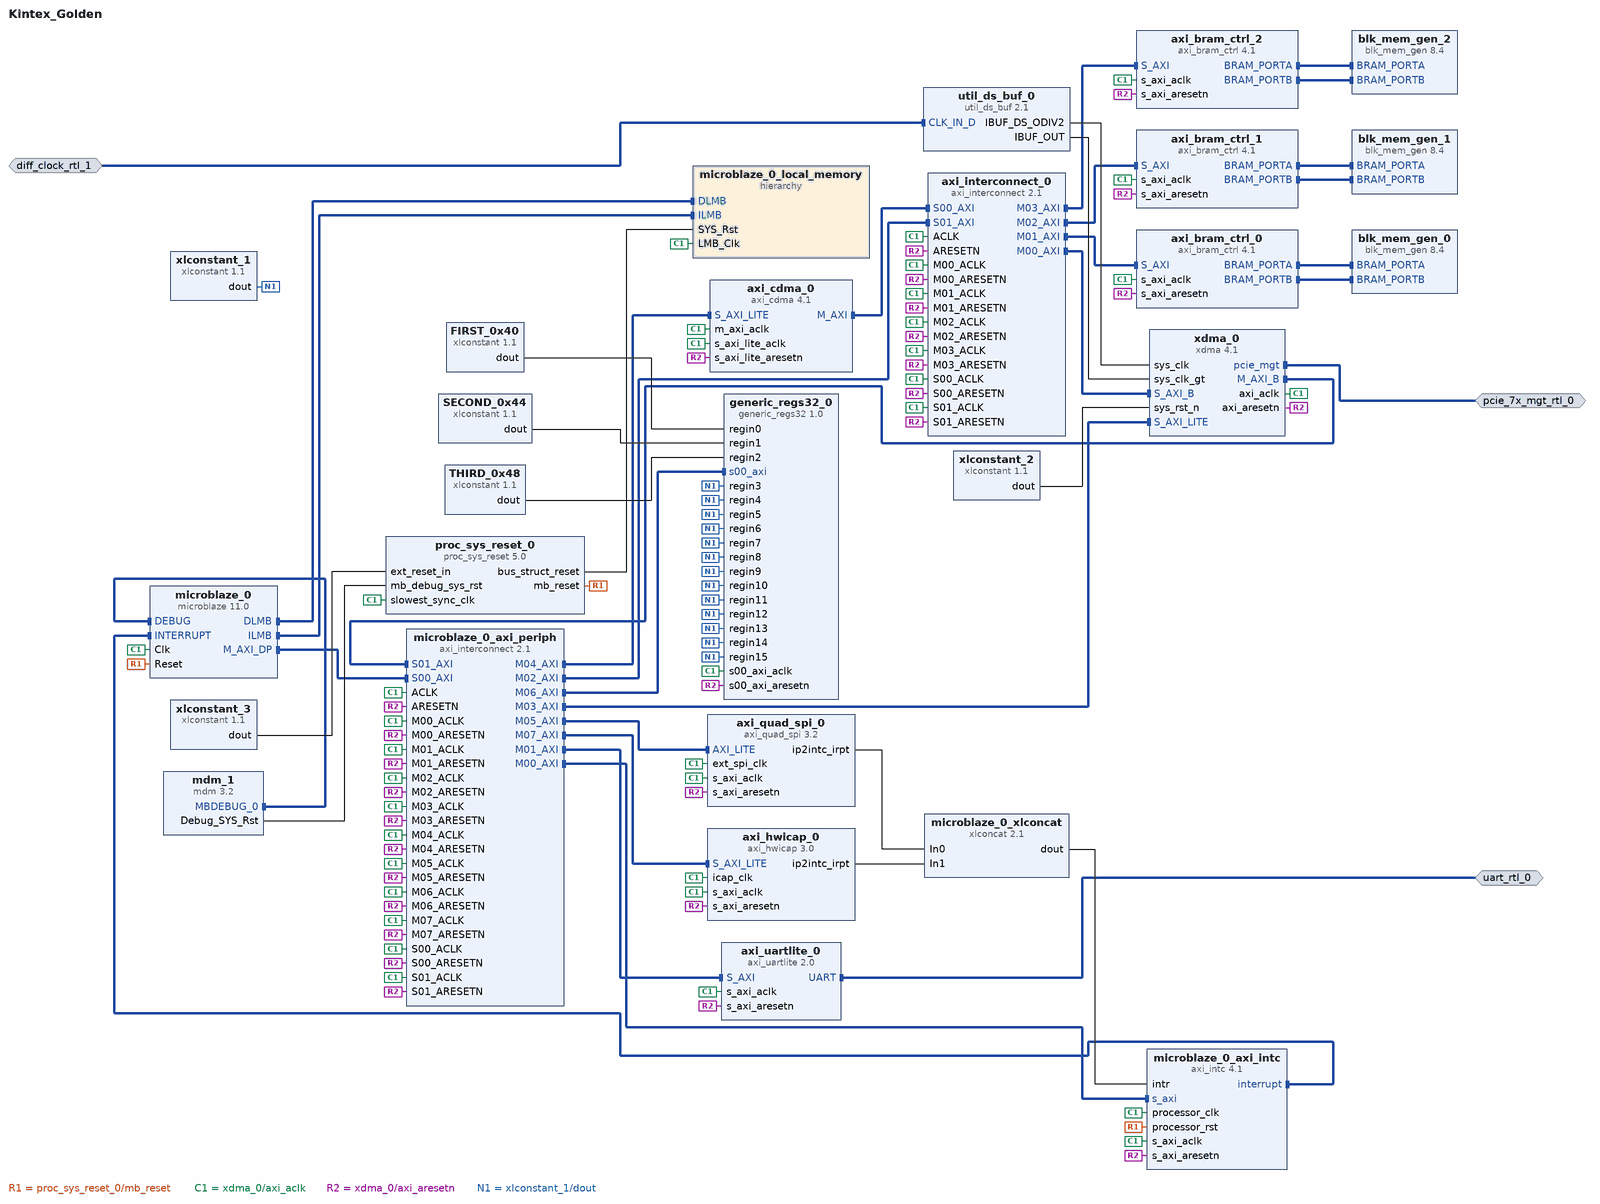
[diagram p0: block diagram of the top level]
# Vivado block design Kintex_Golden, xcku11p-ffva1156-2-i, Vivado 2020.1
create_bd_design Kintex_Golden

create_bd_intf_port -mode Slave -vlnv xilinx.com:interface:diff_clock_rtl:1.0 diff_clock_rtl_1
set_property -dict {CONFIG.FREQ_HZ 100000000} [get_bd_intf_ports diff_clock_rtl_1]
create_bd_intf_port -mode Master -vlnv xilinx.com:interface:pcie_7x_mgt_rtl:1.0 pcie_7x_mgt_rtl_0
create_bd_intf_port -mode Master -vlnv xilinx.com:interface:uart_rtl:1.0 uart_rtl_0

create_bd_cell -type ip -vlnv xilinx.com:ip:xlconstant:1.1 FIRST_0x40
set_property -dict {CONFIG.CONST_VAL 0x424F4F54 CONFIG.CONST_WIDTH 32} [get_bd_cells FIRST_0x40]
create_bd_cell -type ip -vlnv xilinx.com:ip:xlconstant:1.1 SECOND_0x44
set_property -dict {CONFIG.CONST_VAL 0x4C4F4144 CONFIG.CONST_WIDTH 32} [get_bd_cells SECOND_0x44]
create_bd_cell -type ip -vlnv xilinx.com:ip:xlconstant:1.1 THIRD_0x48
set_property -dict {CONFIG.CONST_VAL 0x00020003 CONFIG.CONST_WIDTH 32} [get_bd_cells THIRD_0x48]
create_bd_cell -type ip -vlnv xilinx.com:ip:axi_bram_ctrl:4.1 axi_bram_ctrl_0
create_bd_cell -type ip -vlnv xilinx.com:ip:axi_bram_ctrl:4.1 axi_bram_ctrl_1
create_bd_cell -type ip -vlnv xilinx.com:ip:axi_bram_ctrl:4.1 axi_bram_ctrl_2
create_bd_cell -type ip -vlnv xilinx.com:ip:axi_cdma:4.1 axi_cdma_0
set_property -dict {CONFIG.C_INCLUDE_SG 0} [get_bd_cells axi_cdma_0]
create_bd_cell -type ip -vlnv xilinx.com:ip:axi_hwicap:3.0 axi_hwicap_0
create_bd_cell -type ip -vlnv xilinx.com:ip:axi_interconnect:2.1 axi_interconnect_0
set_property -dict {CONFIG.NUM_MI 4 CONFIG.NUM_SI 2} [get_bd_cells axi_interconnect_0]
create_bd_cell -type ip -vlnv xilinx.com:ip:axi_quad_spi:3.2 axi_quad_spi_0
set_property -dict [list \
  CONFIG.C_FIFO_DEPTH 256 \
  CONFIG.C_SPI_MEMORY 2 \
  CONFIG.C_SPI_MODE 2 \
  CONFIG.C_TYPE_OF_AXI4_INTERFACE 0 \
  CONFIG.C_USE_STARTUP 1 \
  CONFIG.C_USE_STARTUP_INT 1 \
] [get_bd_cells axi_quad_spi_0]
create_bd_cell -type ip -vlnv xilinx.com:ip:axi_uartlite:2.0 axi_uartlite_0
set_property -dict {CONFIG.C_BAUDRATE 115200} [get_bd_cells axi_uartlite_0]
create_bd_cell -type ip -vlnv xilinx.com:ip:blk_mem_gen:8.4 blk_mem_gen_0
set_property -dict [list \
  CONFIG.Enable_B Use_ENB_Pin \
  CONFIG.Memory_Type True_Dual_Port_RAM \
  CONFIG.Port_B_Clock 100 \
  CONFIG.Port_B_Enable_Rate 100 \
  CONFIG.Port_B_Write_Rate 50 \
  CONFIG.Use_RSTB_Pin true \
] [get_bd_cells blk_mem_gen_0]
create_bd_cell -type ip -vlnv xilinx.com:ip:blk_mem_gen:8.4 blk_mem_gen_1
set_property -dict [list \
  CONFIG.Enable_B Use_ENB_Pin \
  CONFIG.Memory_Type True_Dual_Port_RAM \
  CONFIG.Port_B_Clock 100 \
  CONFIG.Port_B_Enable_Rate 100 \
  CONFIG.Port_B_Write_Rate 50 \
  CONFIG.Use_RSTB_Pin true \
] [get_bd_cells blk_mem_gen_1]
create_bd_cell -type ip -vlnv xilinx.com:ip:blk_mem_gen:8.4 blk_mem_gen_2
set_property -dict [list \
  CONFIG.Enable_B Use_ENB_Pin \
  CONFIG.Memory_Type True_Dual_Port_RAM \
  CONFIG.Port_B_Clock 100 \
  CONFIG.Port_B_Enable_Rate 100 \
  CONFIG.Port_B_Write_Rate 50 \
  CONFIG.Use_RSTB_Pin true \
] [get_bd_cells blk_mem_gen_2]
create_bd_cell -type ip -vlnv digital14:mansour:generic_regs32:1.0 generic_regs32_0
create_bd_cell -type ip -vlnv xilinx.com:ip:mdm:3.2 mdm_1
create_bd_cell -type ip -vlnv xilinx.com:ip:microblaze:11.0 microblaze_0
set_property -dict [list \
  CONFIG.C_DEBUG_ENABLED 1 \
  CONFIG.C_D_AXI 1 \
  CONFIG.C_D_LMB 1 \
  CONFIG.C_I_LMB 1 \
  CONFIG.G_TEMPLATE_LIST 8 \
] [get_bd_cells microblaze_0]
create_bd_cell -type ip -vlnv xilinx.com:ip:axi_intc:4.1 microblaze_0_axi_intc
set_property -dict {CONFIG.C_HAS_FAST 1} [get_bd_cells microblaze_0_axi_intc]
create_bd_cell -type ip -vlnv xilinx.com:ip:axi_interconnect:2.1 microblaze_0_axi_periph
set_property -dict {CONFIG.NUM_MI 8 CONFIG.NUM_SI 2} [get_bd_cells microblaze_0_axi_periph]
create_bd_cell -type hier microblaze_0_local_memory
create_bd_cell -type ip -vlnv xilinx.com:ip:xlconcat:2.1 microblaze_0_xlconcat
create_bd_cell -type ip -vlnv xilinx.com:ip:proc_sys_reset:5.0 proc_sys_reset_0
create_bd_cell -type ip -vlnv xilinx.com:ip:util_ds_buf:2.1 util_ds_buf_0
set_property -dict {CONFIG.C_BUF_TYPE IBUFDSGTE} [get_bd_cells util_ds_buf_0]
create_bd_cell -type ip -vlnv xilinx.com:ip:xdma:4.1 xdma_0
set_property -dict [list \
  CONFIG.PF0_DEVICE_ID_mqdma 9021 \
  CONFIG.PF2_DEVICE_ID_mqdma 9021 \
  CONFIG.PF3_DEVICE_ID_mqdma 9021 \
  CONFIG.axi_addr_width 32 \
  CONFIG.axibar_num 6 \
  CONFIG.axisten_freq 125 \
  CONFIG.en_gt_selection true \
  CONFIG.functional_mode AXI_Bridge \
  CONFIG.mode_selection Advanced \
  CONFIG.pciebar2axibar_0 0x00000000 \
  CONFIG.pciebar2axibar_1 0x10000000 \
  CONFIG.pf0_bar1_enabled true \
  CONFIG.pf0_bar1_scale Megabytes \
  CONFIG.pf0_bar1_size 1 \
  CONFIG.pf0_bar2_enabled false \
  CONFIG.pf0_device_id 9022 \
  CONFIG.pf0_subsystem_id 0008 \
  CONFIG.pl_link_cap_max_link_speed 5.0_GT/s \
  CONFIG.plltype QPLL1 \
  CONFIG.select_quad GTH_Quad_224 \
] [get_bd_cells xdma_0]
create_bd_cell -type ip -vlnv xilinx.com:ip:xlconstant:1.1 xlconstant_1
set_property -dict {CONFIG.CONST_VAL 0x0 CONFIG.CONST_WIDTH 32} [get_bd_cells xlconstant_1]
create_bd_cell -type ip -vlnv xilinx.com:ip:xlconstant:1.1 xlconstant_2
create_bd_cell -type ip -vlnv xilinx.com:ip:xlconstant:1.1 xlconstant_3

# ---- hierarchy /microblaze_0_local_memory ----
current_bd_instance /microblaze_0_local_memory
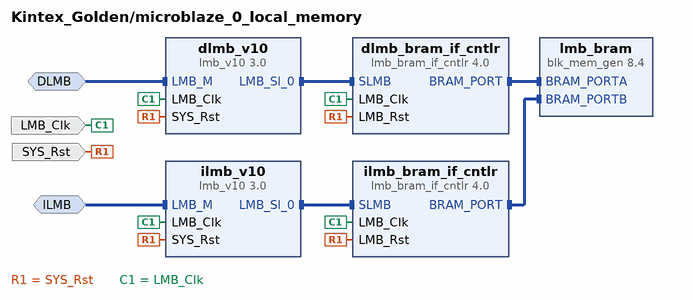
[diagram p1: block diagram inside /microblaze_0_local_memory]
create_bd_intf_pin -mode MirroredMaster -vlnv xilinx.com:interface:lmb_rtl:1.0 DLMB
create_bd_intf_pin -mode MirroredMaster -vlnv xilinx.com:interface:lmb_rtl:1.0 ILMB
create_bd_pin -dir I -type clk LMB_Clk
create_bd_pin -dir I -type rst SYS_Rst

create_bd_cell -type ip -vlnv xilinx.com:ip:lmb_bram_if_cntlr:4.0 dlmb_bram_if_cntlr
set_property -dict {CONFIG.C_ECC 0} [get_bd_cells dlmb_bram_if_cntlr]
create_bd_cell -type ip -vlnv xilinx.com:ip:lmb_v10:3.0 dlmb_v10
create_bd_cell -type ip -vlnv xilinx.com:ip:lmb_bram_if_cntlr:4.0 ilmb_bram_if_cntlr
set_property -dict {CONFIG.C_ECC 0} [get_bd_cells ilmb_bram_if_cntlr]
create_bd_cell -type ip -vlnv xilinx.com:ip:lmb_v10:3.0 ilmb_v10
create_bd_cell -type ip -vlnv xilinx.com:ip:blk_mem_gen:8.4 lmb_bram
set_property -dict {CONFIG.Memory_Type True_Dual_Port_RAM CONFIG.use_bram_block BRAM_Controller} [get_bd_cells lmb_bram]

# ---- connections ----

current_bd_instance /microblaze_0_local_memory
connect_bd_intf_net -intf_net microblaze_0_dlmb [get_bd_intf_pins DLMB] [get_bd_intf_pins dlmb_v10/LMB_M]
connect_bd_intf_net -intf_net microblaze_0_dlmb_bus [get_bd_intf_pins dlmb_bram_if_cntlr/SLMB] [get_bd_intf_pins dlmb_v10/LMB_Sl_0]
connect_bd_intf_net -intf_net microblaze_0_dlmb_cntlr [get_bd_intf_pins dlmb_bram_if_cntlr/BRAM_PORT] [get_bd_intf_pins lmb_bram/BRAM_PORTA]
connect_bd_intf_net -intf_net microblaze_0_ilmb [get_bd_intf_pins ILMB] [get_bd_intf_pins ilmb_v10/LMB_M]
connect_bd_intf_net -intf_net microblaze_0_ilmb_bus [get_bd_intf_pins ilmb_bram_if_cntlr/SLMB] [get_bd_intf_pins ilmb_v10/LMB_Sl_0]
connect_bd_intf_net -intf_net microblaze_0_ilmb_cntlr [get_bd_intf_pins ilmb_bram_if_cntlr/BRAM_PORT] [get_bd_intf_pins lmb_bram/BRAM_PORTB]
connect_bd_net [get_bd_pins SYS_Rst] \
  [get_bd_pins dlmb_bram_if_cntlr/LMB_Rst] [get_bd_pins dlmb_v10/SYS_Rst] [get_bd_pins ilmb_bram_if_cntlr/LMB_Rst] \
  [get_bd_pins ilmb_v10/SYS_Rst]
connect_bd_net -net microblaze_0_Clk [get_bd_pins LMB_Clk] \
  [get_bd_pins dlmb_bram_if_cntlr/LMB_Clk] [get_bd_pins dlmb_v10/LMB_Clk] [get_bd_pins ilmb_bram_if_cntlr/LMB_Clk] \
  [get_bd_pins ilmb_v10/LMB_Clk]
set_property HDL_ATTRIBUTE.BMM_INFO_ADDRESS_SPACE {byte  0x00000000 32 > Kintex_Golden microblaze_0_local_memory/lmb_bram} [get_bd_cells dlmb_bram_if_cntlr]
set_property HDL_ATTRIBUTE.KEEP_HIERARCHY yes [get_bd_cells dlmb_bram_if_cntlr]

current_bd_instance /
connect_bd_intf_net [get_bd_intf_ports uart_rtl_0] [get_bd_intf_pins axi_uartlite_0/UART]
connect_bd_intf_net -intf_net diff_clock_rtl_1_1 [get_bd_intf_ports diff_clock_rtl_1] [get_bd_intf_pins util_ds_buf_0/CLK_IN_D]
connect_bd_intf_net -intf_net microblaze_0_axi_dp [get_bd_intf_pins microblaze_0/M_AXI_DP] [get_bd_intf_pins microblaze_0_axi_periph/S00_AXI]
connect_bd_intf_net [get_bd_intf_pins axi_uartlite_0/S_AXI] [get_bd_intf_pins microblaze_0_axi_periph/M01_AXI]
connect_bd_intf_net [get_bd_intf_pins axi_interconnect_0/S01_AXI] [get_bd_intf_pins microblaze_0_axi_periph/M02_AXI]
connect_bd_intf_net [get_bd_intf_pins axi_quad_spi_0/AXI_LITE] [get_bd_intf_pins microblaze_0_axi_periph/M05_AXI]
connect_bd_intf_net [get_bd_intf_pins generic_regs32_0/s00_axi] [get_bd_intf_pins microblaze_0_axi_periph/M06_AXI]
connect_bd_intf_net [get_bd_intf_pins axi_cdma_0/S_AXI_LITE] [get_bd_intf_pins microblaze_0_axi_periph/M04_AXI]
connect_bd_intf_net [get_bd_intf_pins axi_hwicap_0/S_AXI_LITE] [get_bd_intf_pins microblaze_0_axi_periph/M07_AXI]
connect_bd_intf_net [get_bd_intf_pins mdm_1/MBDEBUG_0] [get_bd_intf_pins microblaze_0/DEBUG]
connect_bd_intf_net [get_bd_intf_pins microblaze_0/DLMB] [get_bd_intf_pins microblaze_0_local_memory/DLMB]
connect_bd_intf_net [get_bd_intf_pins microblaze_0/ILMB] [get_bd_intf_pins microblaze_0_local_memory/ILMB]
connect_bd_intf_net -intf_net microblaze_0_intc_axi [get_bd_intf_pins microblaze_0_axi_intc/s_axi] [get_bd_intf_pins microblaze_0_axi_periph/M00_AXI]
connect_bd_intf_net [get_bd_intf_pins microblaze_0/INTERRUPT] [get_bd_intf_pins microblaze_0_axi_intc/interrupt]
connect_bd_intf_net [get_bd_intf_pins microblaze_0_axi_periph/S01_AXI] [get_bd_intf_pins xdma_0/M_AXI_B]
connect_bd_intf_net [get_bd_intf_ports pcie_7x_mgt_rtl_0] [get_bd_intf_pins xdma_0/pcie_mgt]
connect_bd_intf_net [get_bd_intf_pins microblaze_0_axi_periph/M03_AXI] [get_bd_intf_pins xdma_0/S_AXI_LITE]
connect_bd_intf_net [get_bd_intf_pins axi_bram_ctrl_0/BRAM_PORTA] [get_bd_intf_pins blk_mem_gen_0/BRAM_PORTA]
connect_bd_intf_net -intf_net axi_bram_ctrl_0_BRAM_PORTA1 [get_bd_intf_pins axi_bram_ctrl_1/BRAM_PORTA] [get_bd_intf_pins blk_mem_gen_1/BRAM_PORTA]
connect_bd_intf_net -intf_net axi_bram_ctrl_0_BRAM_PORTA2 [get_bd_intf_pins axi_bram_ctrl_2/BRAM_PORTA] [get_bd_intf_pins blk_mem_gen_2/BRAM_PORTA]
connect_bd_intf_net [get_bd_intf_pins axi_bram_ctrl_0/BRAM_PORTB] [get_bd_intf_pins blk_mem_gen_0/BRAM_PORTB]
connect_bd_intf_net -intf_net axi_bram_ctrl_0_BRAM_PORTB1 [get_bd_intf_pins axi_bram_ctrl_1/BRAM_PORTB] [get_bd_intf_pins blk_mem_gen_1/BRAM_PORTB]
connect_bd_intf_net -intf_net axi_bram_ctrl_0_BRAM_PORTB2 [get_bd_intf_pins axi_bram_ctrl_2/BRAM_PORTB] [get_bd_intf_pins blk_mem_gen_2/BRAM_PORTB]
connect_bd_intf_net [get_bd_intf_pins axi_cdma_0/M_AXI] [get_bd_intf_pins axi_interconnect_0/S00_AXI]
connect_bd_intf_net [get_bd_intf_pins axi_interconnect_0/M00_AXI] [get_bd_intf_pins xdma_0/S_AXI_B]
connect_bd_intf_net [get_bd_intf_pins axi_bram_ctrl_0/S_AXI] [get_bd_intf_pins axi_interconnect_0/M01_AXI]
connect_bd_intf_net [get_bd_intf_pins axi_bram_ctrl_1/S_AXI] [get_bd_intf_pins axi_interconnect_0/M02_AXI]
connect_bd_intf_net [get_bd_intf_pins axi_bram_ctrl_2/S_AXI] [get_bd_intf_pins axi_interconnect_0/M03_AXI]
connect_bd_net [get_bd_pins FIRST_0x40/dout] [get_bd_pins generic_regs32_0/regin0]
connect_bd_net [get_bd_pins SECOND_0x44/dout] [get_bd_pins generic_regs32_0/regin1]
connect_bd_net [get_bd_pins THIRD_0x48/dout] [get_bd_pins generic_regs32_0/regin2]
connect_bd_net [get_bd_pins axi_hwicap_0/ip2intc_irpt] [get_bd_pins microblaze_0_xlconcat/In1]
connect_bd_net [get_bd_pins axi_quad_spi_0/ip2intc_irpt] [get_bd_pins microblaze_0_xlconcat/In0]
connect_bd_net [get_bd_pins mdm_1/Debug_SYS_Rst] [get_bd_pins proc_sys_reset_0/mb_debug_sys_rst]
connect_bd_net -net microblaze_0_intr [get_bd_pins microblaze_0_xlconcat/dout] [get_bd_pins microblaze_0_axi_intc/intr]
connect_bd_net [get_bd_pins proc_sys_reset_0/bus_struct_reset] [get_bd_pins microblaze_0_local_memory/SYS_Rst]
connect_bd_net [get_bd_pins proc_sys_reset_0/mb_reset] [get_bd_pins microblaze_0/Reset] [get_bd_pins microblaze_0_axi_intc/processor_rst]
connect_bd_net [get_bd_pins util_ds_buf_0/IBUF_DS_ODIV2] [get_bd_pins xdma_0/sys_clk]
connect_bd_net [get_bd_pins util_ds_buf_0/IBUF_OUT] [get_bd_pins xdma_0/sys_clk_gt]
connect_bd_net [get_bd_pins xdma_0/axi_aclk] \
  [get_bd_pins axi_bram_ctrl_0/s_axi_aclk] [get_bd_pins axi_bram_ctrl_1/s_axi_aclk] [get_bd_pins axi_bram_ctrl_2/s_axi_aclk] \
  [get_bd_pins axi_cdma_0/m_axi_aclk] [get_bd_pins axi_cdma_0/s_axi_lite_aclk] [get_bd_pins axi_hwicap_0/icap_clk] \
  [get_bd_pins axi_hwicap_0/s_axi_aclk] [get_bd_pins axi_interconnect_0/ACLK] [get_bd_pins axi_interconnect_0/M00_ACLK] \
  [get_bd_pins axi_interconnect_0/M01_ACLK] [get_bd_pins axi_interconnect_0/M02_ACLK] \
  [get_bd_pins axi_interconnect_0/M03_ACLK] [get_bd_pins axi_interconnect_0/S00_ACLK] \
  [get_bd_pins axi_interconnect_0/S01_ACLK] [get_bd_pins axi_quad_spi_0/ext_spi_clk] [get_bd_pins axi_quad_spi_0/s_axi_aclk] \
  [get_bd_pins axi_uartlite_0/s_axi_aclk] [get_bd_pins generic_regs32_0/s00_axi_aclk] [get_bd_pins microblaze_0/Clk] \
  [get_bd_pins microblaze_0_axi_intc/processor_clk] [get_bd_pins microblaze_0_axi_intc/s_axi_aclk] \
  [get_bd_pins microblaze_0_axi_periph/ACLK] [get_bd_pins microblaze_0_axi_periph/M00_ACLK] \
  [get_bd_pins microblaze_0_axi_periph/M01_ACLK] [get_bd_pins microblaze_0_axi_periph/M02_ACLK] \
  [get_bd_pins microblaze_0_axi_periph/M03_ACLK] [get_bd_pins microblaze_0_axi_periph/M04_ACLK] \
  [get_bd_pins microblaze_0_axi_periph/M05_ACLK] [get_bd_pins microblaze_0_axi_periph/M06_ACLK] \
  [get_bd_pins microblaze_0_axi_periph/M07_ACLK] [get_bd_pins microblaze_0_axi_periph/S00_ACLK] \
  [get_bd_pins microblaze_0_axi_periph/S01_ACLK] [get_bd_pins microblaze_0_local_memory/LMB_Clk] \
  [get_bd_pins proc_sys_reset_0/slowest_sync_clk]
connect_bd_net [get_bd_pins xdma_0/axi_aresetn] \
  [get_bd_pins axi_bram_ctrl_0/s_axi_aresetn] [get_bd_pins axi_bram_ctrl_1/s_axi_aresetn] \
  [get_bd_pins axi_bram_ctrl_2/s_axi_aresetn] [get_bd_pins axi_cdma_0/s_axi_lite_aresetn] \
  [get_bd_pins axi_hwicap_0/s_axi_aresetn] [get_bd_pins axi_interconnect_0/ARESETN] \
  [get_bd_pins axi_interconnect_0/M00_ARESETN] [get_bd_pins axi_interconnect_0/M01_ARESETN] \
  [get_bd_pins axi_interconnect_0/M02_ARESETN] [get_bd_pins axi_interconnect_0/M03_ARESETN] \
  [get_bd_pins axi_interconnect_0/S00_ARESETN] [get_bd_pins axi_interconnect_0/S01_ARESETN] \
  [get_bd_pins axi_quad_spi_0/s_axi_aresetn] [get_bd_pins axi_uartlite_0/s_axi_aresetn] \
  [get_bd_pins generic_regs32_0/s00_axi_aresetn] [get_bd_pins microblaze_0_axi_intc/s_axi_aresetn] \
  [get_bd_pins microblaze_0_axi_periph/ARESETN] [get_bd_pins microblaze_0_axi_periph/M00_ARESETN] \
  [get_bd_pins microblaze_0_axi_periph/M01_ARESETN] [get_bd_pins microblaze_0_axi_periph/M02_ARESETN] \
  [get_bd_pins microblaze_0_axi_periph/M03_ARESETN] [get_bd_pins microblaze_0_axi_periph/M04_ARESETN] \
  [get_bd_pins microblaze_0_axi_periph/M05_ARESETN] [get_bd_pins microblaze_0_axi_periph/M06_ARESETN] \
  [get_bd_pins microblaze_0_axi_periph/M07_ARESETN] [get_bd_pins microblaze_0_axi_periph/S00_ARESETN] \
  [get_bd_pins microblaze_0_axi_periph/S01_ARESETN]
connect_bd_net [get_bd_pins xlconstant_1/dout] \
  [get_bd_pins generic_regs32_0/regin3] [get_bd_pins generic_regs32_0/regin4] [get_bd_pins generic_regs32_0/regin5] \
  [get_bd_pins generic_regs32_0/regin6] [get_bd_pins generic_regs32_0/regin7] [get_bd_pins generic_regs32_0/regin8] \
  [get_bd_pins generic_regs32_0/regin9] [get_bd_pins generic_regs32_0/regin10] [get_bd_pins generic_regs32_0/regin11] \
  [get_bd_pins generic_regs32_0/regin12] [get_bd_pins generic_regs32_0/regin13] [get_bd_pins generic_regs32_0/regin14] \
  [get_bd_pins generic_regs32_0/regin15]
connect_bd_net [get_bd_pins xlconstant_2/dout] [get_bd_pins xdma_0/sys_rst_n]
connect_bd_net [get_bd_pins xlconstant_3/dout] [get_bd_pins proc_sys_reset_0/ext_reset_in]
set_property HDL_ATTRIBUTE.BMM_INFO_ADDRESS_SPACE {byte  0x10010000 32 > Kintex_Golden blk_mem_gen_0} [get_bd_cells axi_bram_ctrl_0]
set_property HDL_ATTRIBUTE.KEEP_HIERARCHY yes [get_bd_cells axi_bram_ctrl_0]
set_property HDL_ATTRIBUTE.BMM_INFO_ADDRESS_SPACE {byte  0x10011000 32 > Kintex_Golden blk_mem_gen_1} [get_bd_cells axi_bram_ctrl_1]
set_property HDL_ATTRIBUTE.KEEP_HIERARCHY yes [get_bd_cells axi_bram_ctrl_1]
set_property HDL_ATTRIBUTE.BMM_INFO_ADDRESS_SPACE {byte  0x10012000 32 > Kintex_Golden blk_mem_gen_2} [get_bd_cells axi_bram_ctrl_2]
set_property HDL_ATTRIBUTE.KEEP_HIERARCHY yes [get_bd_cells axi_bram_ctrl_2]
set_property HDL_ATTRIBUTE.BMM_INFO_PROCESSOR {microblaze-le > Kintex_Golden microblaze_0_local_memory/dlmb_bram_if_cntlr Kintex_Golden axi_bram_ctrl_0 Kintex_Golden axi_bram_ctrl_1 Kintex_Golden axi_bram_ctrl_2} [get_bd_cells microblaze_0]
set_property HDL_ATTRIBUTE.KEEP_HIERARCHY yes [get_bd_cells microblaze_0]

# ---- address map ----
assign_bd_address -offset 0x10010000 -range 4K -target_address_space [get_bd_addr_spaces axi_cdma_0/Data] [get_bd_addr_segs axi_bram_ctrl_0/S_AXI/Mem0]
assign_bd_address -offset 0x10011000 -range 4K -target_address_space [get_bd_addr_spaces axi_cdma_0/Data] [get_bd_addr_segs axi_bram_ctrl_1/S_AXI/Mem0]
assign_bd_address -offset 0x10012000 -range 4K -target_address_space [get_bd_addr_spaces axi_cdma_0/Data] [get_bd_addr_segs axi_bram_ctrl_2/S_AXI/Mem0]
assign_bd_address -offset 0x90000000 -range 2M -target_address_space [get_bd_addr_spaces axi_cdma_0/Data] [get_bd_addr_segs xdma_0/S_AXI_B/BAR0]
assign_bd_address -offset 0x90200000 -range 2M -target_address_space [get_bd_addr_spaces axi_cdma_0/Data] [get_bd_addr_segs xdma_0/S_AXI_B/BAR5]
assign_bd_address -offset 0x90400000 -range 2M -target_address_space [get_bd_addr_spaces axi_cdma_0/Data] [get_bd_addr_segs xdma_0/S_AXI_B/BAR1]
assign_bd_address -offset 0x90600000 -range 2M -target_address_space [get_bd_addr_spaces axi_cdma_0/Data] [get_bd_addr_segs xdma_0/S_AXI_B/BAR2]
assign_bd_address -offset 0x90800000 -range 2M -target_address_space [get_bd_addr_spaces axi_cdma_0/Data] [get_bd_addr_segs xdma_0/S_AXI_B/BAR3]
assign_bd_address -offset 0x90A00000 -range 2M -target_address_space [get_bd_addr_spaces axi_cdma_0/Data] [get_bd_addr_segs xdma_0/S_AXI_B/BAR4]
assign_bd_address -offset 0x00000000 -range 128K -target_address_space [get_bd_addr_spaces microblaze_0/Data] [get_bd_addr_segs microblaze_0_local_memory/dlmb_bram_if_cntlr/SLMB/Mem]
assign_bd_address -offset 0x10000000 -range 64K -target_address_space [get_bd_addr_spaces microblaze_0/Data] [get_bd_addr_segs axi_cdma_0/S_AXI_LITE/Reg]
assign_bd_address -offset 0x10010000 -range 4K -target_address_space [get_bd_addr_spaces microblaze_0/Data] [get_bd_addr_segs axi_bram_ctrl_0/S_AXI/Mem0]
assign_bd_address -offset 0x10011000 -range 4K -target_address_space [get_bd_addr_spaces microblaze_0/Data] [get_bd_addr_segs axi_bram_ctrl_1/S_AXI/Mem0]
assign_bd_address -offset 0x10012000 -range 4K -target_address_space [get_bd_addr_spaces microblaze_0/Data] [get_bd_addr_segs axi_bram_ctrl_2/S_AXI/Mem0]
assign_bd_address -offset 0x10020000 -range 64K -target_address_space [get_bd_addr_spaces microblaze_0/Data] [get_bd_addr_segs axi_hwicap_0/S_AXI_LITE/Reg]
assign_bd_address -offset 0x10030000 -range 64K -target_address_space [get_bd_addr_spaces microblaze_0/Data] [get_bd_addr_segs generic_regs32_0/s00_axi/reg0]
assign_bd_address -offset 0x40600000 -range 64K -target_address_space [get_bd_addr_spaces microblaze_0/Data] [get_bd_addr_segs axi_uartlite_0/S_AXI/Reg]
assign_bd_address -offset 0x41200000 -range 64K -target_address_space [get_bd_addr_spaces microblaze_0/Data] [get_bd_addr_segs microblaze_0_axi_intc/S_AXI/Reg]
assign_bd_address -offset 0x44A00000 -range 64K -target_address_space [get_bd_addr_spaces microblaze_0/Data] [get_bd_addr_segs axi_quad_spi_0/AXI_LITE/Reg]
exclude_bd_addr_seg -offset 0x00000000 -range 1 -target_address_space [get_bd_addr_spaces microblaze_0/Data] [get_bd_addr_segs xdma_0/S_AXI_LITE/CTL0]
exclude_bd_addr_seg -offset 0x20000000 -range 512M -target_address_space [get_bd_addr_spaces microblaze_0/Data] [get_bd_addr_segs xdma_0/S_AXI_LITE/CTL0]
exclude_bd_addr_seg -offset 0x90000000 -range 2M -target_address_space [get_bd_addr_spaces microblaze_0/Data] [get_bd_addr_segs xdma_0/S_AXI_B/BAR0]
exclude_bd_addr_seg -offset 0x90000000 -range 2M -target_address_space [get_bd_addr_spaces microblaze_0/Data] [get_bd_addr_segs xdma_0/S_AXI_B/BAR1]
exclude_bd_addr_seg -offset 0x90000000 -range 2M -target_address_space [get_bd_addr_spaces microblaze_0/Data] [get_bd_addr_segs xdma_0/S_AXI_B/BAR2]
exclude_bd_addr_seg -offset 0x90000000 -range 2M -target_address_space [get_bd_addr_spaces microblaze_0/Data] [get_bd_addr_segs xdma_0/S_AXI_B/BAR3]
exclude_bd_addr_seg -offset 0x90000000 -range 2M -target_address_space [get_bd_addr_spaces microblaze_0/Data] [get_bd_addr_segs xdma_0/S_AXI_B/BAR4]
exclude_bd_addr_seg -offset 0x90000000 -range 2M -target_address_space [get_bd_addr_spaces microblaze_0/Data] [get_bd_addr_segs xdma_0/S_AXI_B/BAR5]
assign_bd_address -offset 0x00000000 -range 128K -target_address_space [get_bd_addr_spaces microblaze_0/Instruction] [get_bd_addr_segs microblaze_0_local_memory/ilmb_bram_if_cntlr/SLMB/Mem]
assign_bd_address -offset 0x00000000 -range 256M -target_address_space [get_bd_addr_spaces xdma_0/M_AXI_B] [get_bd_addr_segs xdma_0/S_AXI_LITE/CTL0]
assign_bd_address -offset 0x10000000 -range 64K -target_address_space [get_bd_addr_spaces xdma_0/M_AXI_B] [get_bd_addr_segs axi_cdma_0/S_AXI_LITE/Reg]
assign_bd_address -offset 0x10010000 -range 4K -target_address_space [get_bd_addr_spaces xdma_0/M_AXI_B] [get_bd_addr_segs axi_bram_ctrl_0/S_AXI/Mem0]
assign_bd_address -offset 0x10011000 -range 4K -target_address_space [get_bd_addr_spaces xdma_0/M_AXI_B] [get_bd_addr_segs axi_bram_ctrl_1/S_AXI/Mem0]
assign_bd_address -offset 0x10012000 -range 4K -target_address_space [get_bd_addr_spaces xdma_0/M_AXI_B] [get_bd_addr_segs axi_bram_ctrl_2/S_AXI/Mem0]
assign_bd_address -offset 0x10020000 -range 64K -target_address_space [get_bd_addr_spaces xdma_0/M_AXI_B] [get_bd_addr_segs axi_hwicap_0/S_AXI_LITE/Reg]
assign_bd_address -offset 0x10030000 -range 64K -target_address_space [get_bd_addr_spaces xdma_0/M_AXI_B] [get_bd_addr_segs generic_regs32_0/s00_axi/reg0]
exclude_bd_addr_seg -offset 0x40600000 -range 64K -target_address_space [get_bd_addr_spaces xdma_0/M_AXI_B] [get_bd_addr_segs axi_uartlite_0/S_AXI/Reg]
exclude_bd_addr_seg -offset 0x41200000 -range 64K -target_address_space [get_bd_addr_spaces xdma_0/M_AXI_B] [get_bd_addr_segs microblaze_0_axi_intc/S_AXI/Reg]
exclude_bd_addr_seg -offset 0x44A00000 -range 64K -target_address_space [get_bd_addr_spaces xdma_0/M_AXI_B] [get_bd_addr_segs axi_quad_spi_0/AXI_LITE/Reg]
exclude_bd_addr_seg -offset 0x90000000 -range 2M -target_address_space [get_bd_addr_spaces xdma_0/M_AXI_B] [get_bd_addr_segs xdma_0/S_AXI_B/BAR0]
exclude_bd_addr_seg -offset 0x90000000 -range 2M -target_address_space [get_bd_addr_spaces xdma_0/M_AXI_B] [get_bd_addr_segs xdma_0/S_AXI_B/BAR1]
exclude_bd_addr_seg -offset 0x90000000 -range 2M -target_address_space [get_bd_addr_spaces xdma_0/M_AXI_B] [get_bd_addr_segs xdma_0/S_AXI_B/BAR2]
exclude_bd_addr_seg -offset 0x90000000 -range 2M -target_address_space [get_bd_addr_spaces xdma_0/M_AXI_B] [get_bd_addr_segs xdma_0/S_AXI_B/BAR3]
exclude_bd_addr_seg -offset 0x90000000 -range 2M -target_address_space [get_bd_addr_spaces xdma_0/M_AXI_B] [get_bd_addr_segs xdma_0/S_AXI_B/BAR4]
exclude_bd_addr_seg -offset 0x90000000 -range 2M -target_address_space [get_bd_addr_spaces xdma_0/M_AXI_B] [get_bd_addr_segs xdma_0/S_AXI_B/BAR5]

validate_bd_design
save_bd_design
